# EasyEDA schematic Schem_Vehicle_Tracking_System.json
TITLE: Vehicle_Tracking_System; REV: 1.0; Date: 2023-11-12; Sheet: 1/1; Company: Your Company
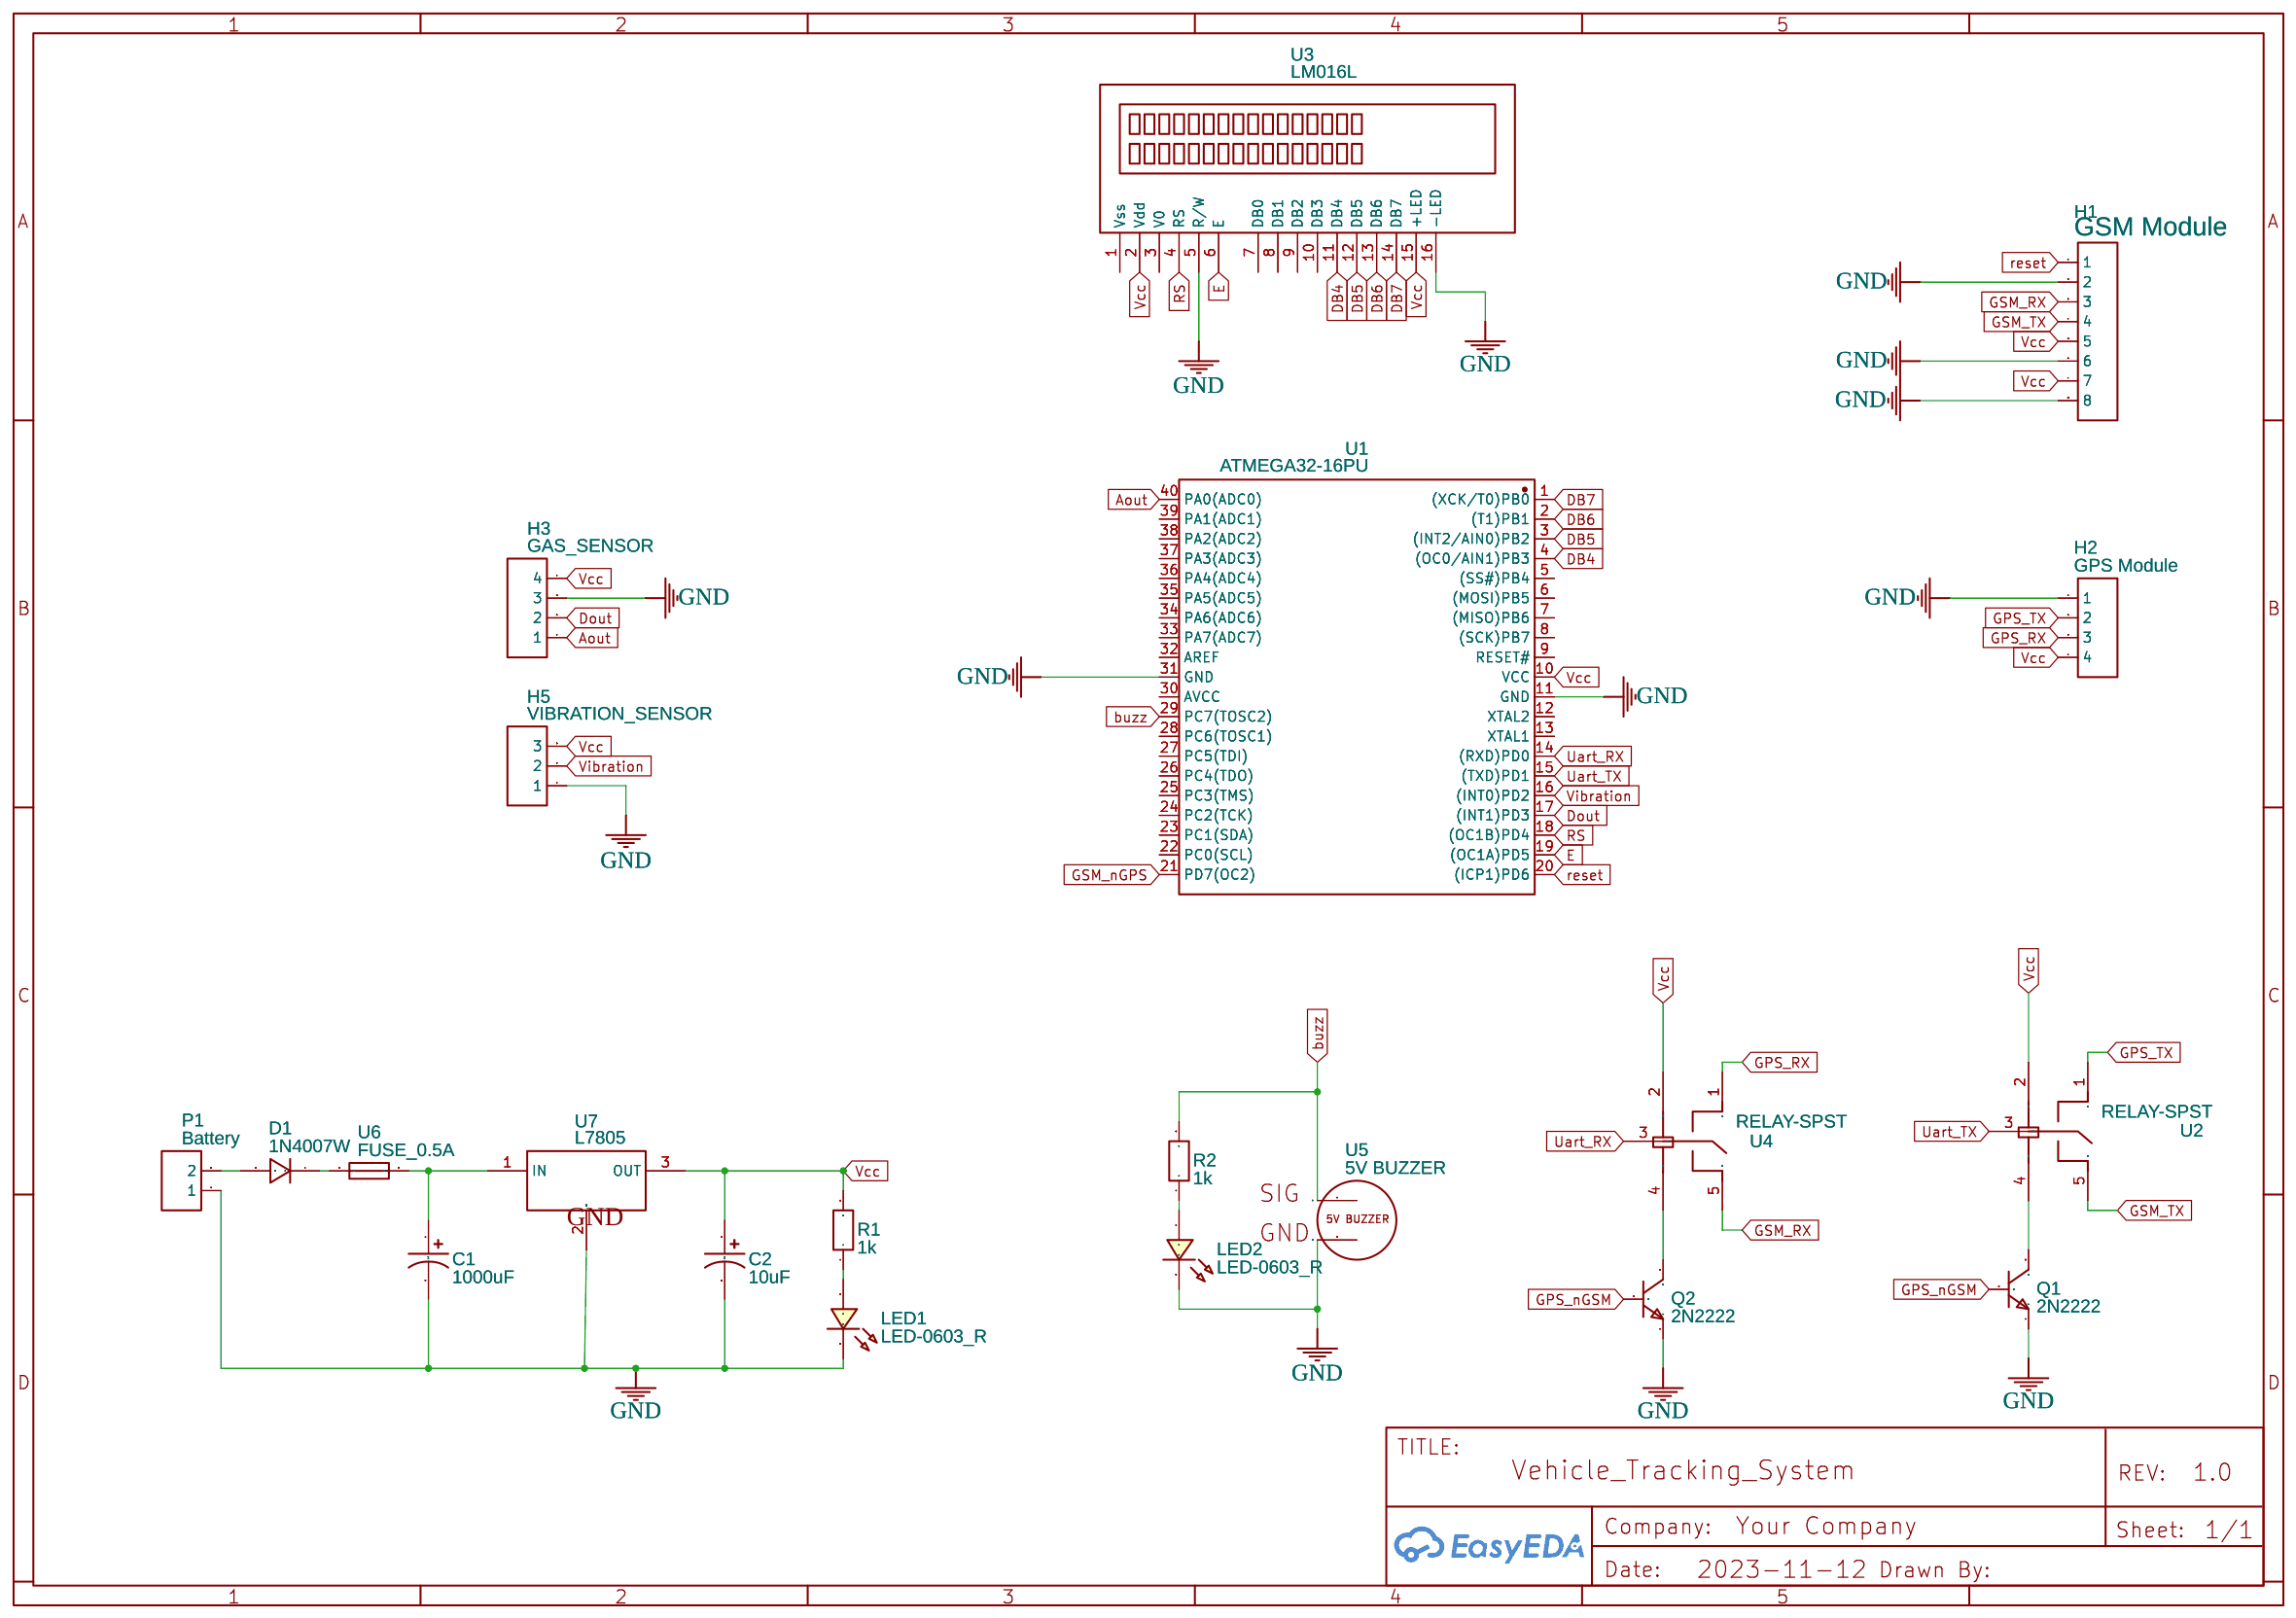
[diagram p0: schematic sheet]

## Parts
C1  1000uF  [CASE-A_3216]
C2  10uF  [CASE-A_3216]
D1  1N4007W  [SOD-123_L2.8-W1.8-LS3.7-RD]
H1  GSM Module  [HDR-F-2.54_1X8]
H2  GPS Module  [HDR-F-2.54_1X4]
H3  GAS_SENSOR  [HDR-F-2.54_1X4]
H5  VIBRATION_SENSOR  [HDR-F-2.54_1X3]
LED1  LED-0603_R  [LED0603_RED]
LED2  LED-0603_R  [LED0603_RED]
P1  Battery  [HDR-F-2.54_1X2]
Q1  2N2222  [TO-92-3_L4.9-W3.7-P1.27-L]
Q2  2N2222  [TO-92-3_L4.9-W3.7-P1.27-L]
R1  1k  [R0603]
R2  1k  [R0603]
U1  ATMEGA32-16PU  [DIP-40_L52.3-W13.9-P2.54-LS15.2-BL]
U2  RELAY-SPST  [RELAY-TH_RELAY-SPST]
U3  LM016L  [LM016L]
U4  RELAY-SPST  [RELAY-TH_RELAY-SPST]
U5  5V BUZZER  [5V BUZZER]
U6  FUSE_0.5A  [FUSE-TH_L8.9-W2.0-P5.00-D0.6-S0.80]
U7  L7805  [TO-220AB-3_L10.4-W4.6-P2.54-L]

## Library data of the parts
C1 C2 = C_Tan_SMD_A_US: Contributor: LCEDA_Lib
D1 = 1N4007W: Supplier: LCSC; Supplier Part: C328592; Manufacturer: BLUE ROCKET; Contributor: LCEDA_Lib
H1 = HDR-F-2.54_1x8: Supplier Part: C225505; Supplier: LCSC; Contributor: LCEDA_Lib
H2 H3 = HDR-F-2.54_1x4: Supplier Part: C225501; Supplier: LCSC; Contributor: LCEDA_Lib
H5 = HDR-F-2.54_1x3: Supplier Part: C146690; Supplier: LCSC; Contributor: LCEDA_Lib
LED1 LED2 = LED-0603_R: Manufacturer: EVERLIGHT(台湾亿光); Manufacturer Part: 19-217/R6C-AL1M2VY/3T; Supplier Part: C72044; Supplier: LCSC; Contributor: LCEDA_01
P1 = HDR-F-2.54_1x2: Supplier Part: C49661; Supplier: LCSC; Contributor: LCEDA_Lib
Q1 Q2 = 2N2222: Contributor: LCSC; Supplier: LCSC; Manufacturer: ST(先科); Manufacturer Part: 2N2222A; Supplier Part: C118536; JLCPCB Part Class: Extended Part; link: https://lcsc.com/eda_search?q=C118536&%26type=1&ref=editor
R1 R2 = R_0603_EU: Contributor: LCEDA_Lib
U1 = ATMEGA32-16PU: Contributor: LCSC; Supplier: LCSC; Supplier Part: C1337273; Manufacturer: MICROCHIP(美国微芯); JLCPCB Part Class: Extended Part; link: https://lcsc.com/eda_search?q=C1337273&%26type=1&ref=editor
U2 U4 = RELAY-SPST: Contributor: LCSC; Supplier: LCSC; Supplier Part: C2941249; Manufacturer: null; Manufacturer Part: Relay-SPST; JLCPCB Part Class: Extended Part; link: https://lcsc.com/eda_search?q=C2941249&%26type=1&ref=editor
U3 = LM016L: Manufacturer Part: LCD LM016L 16x2; Contributor: salindasym
U5 = 5V BUZZER: Contributor: diontarrant
U6 = FUSE_0.5A: Contributor: lcsc; Supplier: LCSC; Supplier Part: C9900015003; Manufacturer: null; Manufacturer Part: Fuse_0.5A; JLCPCB Part Class: Extended Part; link: https://lcsc.com/eda_search?q=C9900015003&%26type=1&ref=editor
U7 = L7805: Contributor: lcsc; Supplier: LCSC; Supplier Part: C7426851; Manufacturer: SY(顺烨）; link: https://lcsc.com/eda_search?q=C7426851&%26type=1&ref=editor

## Nets
GND: C1.2 C2.2 H1.2 H1.6 H1.8 H2.1 H3.3 H5.1 LED1.2 LED2.2 P1.1 Q1.1(E) Q2.1(E) U1.11(GND) U1.31(GND) U3.5(R/W) U3.16(-LED) U7.2(GND)
Vcc: C2.1 H1.5 H1.7 H2.4 H3.4 H5.3 R1.2 U1.10(VCC) U2.2 U3.2(Vdd) U3.15(+LED) U4.2 U7.3(OUT)
Aout: H3.1 U1.40(PA0(ADC0))
buzz: R2.2 U1.29(PC7(TOSC2))
DB4: U1.4((OC0/AIN1)PB3) U3.11(DB4)
DB5: U1.3((INT2/AIN0)PB2) U3.12(DB5)
DB6: U1.2((T1)PB1) U3.13(DB6)
DB7: U1.1((XCK/T0)PB0) U3.14(DB7)
Dout: H3.2 U1.17((INT1)PD3)
E: U1.19((OC1A)PD5) U3.6(E)
GPS_nGSM: Q1.2(B) Q2.2(B)
GPS_RX: H2.3 U4.1
GPS_TX: H2.2 U2.1
GSM_nGPS: U1.21(PD7(OC2))
GSM_RX: H1.3 U4.5
GSM_TX: H1.4 U2.5
reset: H1.1 U1.20((ICP1)PD6)
RS: U1.18((OC1B)PD4) U3.4(RS)
Uart_RX: U1.14((RXD)PD0) U4.3
Uart_TX: U1.15((TXD)PD1) U2.3
Vibration: H5.2 U1.16((INT0)PD2)
Net-(C1-1): C1.1 U6.2 U7.1(IN)
Net-(D1-1): D1.1 U6.1
Net-(D1-2): D1.2 P1.2
Net-(LED1-1): LED1.1 R1.1
Net-(LED2-1): LED2.1 R2.1
Net-(Q1-3): Q1.3(C) U2.4
Net-(Q2-3): Q2.3(C) U4.4

Not connected (* = marked no-connect by the designer): U1 5((SS#)PB4) 6((MOSI)PB5) 7((MISO)PB6) 8((SCK)PB7) 9(RESET#) 12(XTAL2) 13(XTAL1) 22(PC0(SCL)) 23(PC1(SDA)) 24(PC2(TCK)) 25(PC3(TMS)) 26(PC4(TDO)) 27(PC5(TDI)) 28(PC6(TOSC1)) 30(AVCC) 32(AREF) 33(PA7(ADC7)) 34(PA6(ADC6)) 35(PA5(ADC5)) 36(PA4(ADC4)) 37(PA3(ADC3)) 38(PA2(ADC2)) 39(PA1(ADC1)); U3 1(Vss) 3(V0) 7(DB0) 8(DB1) 9(DB2) 10(DB3); U5 1 2
